# EAGLE design CCM_0013 (EAGLE 9.0.1)

## Sheet 1 of 3: CCM Subrack Bus
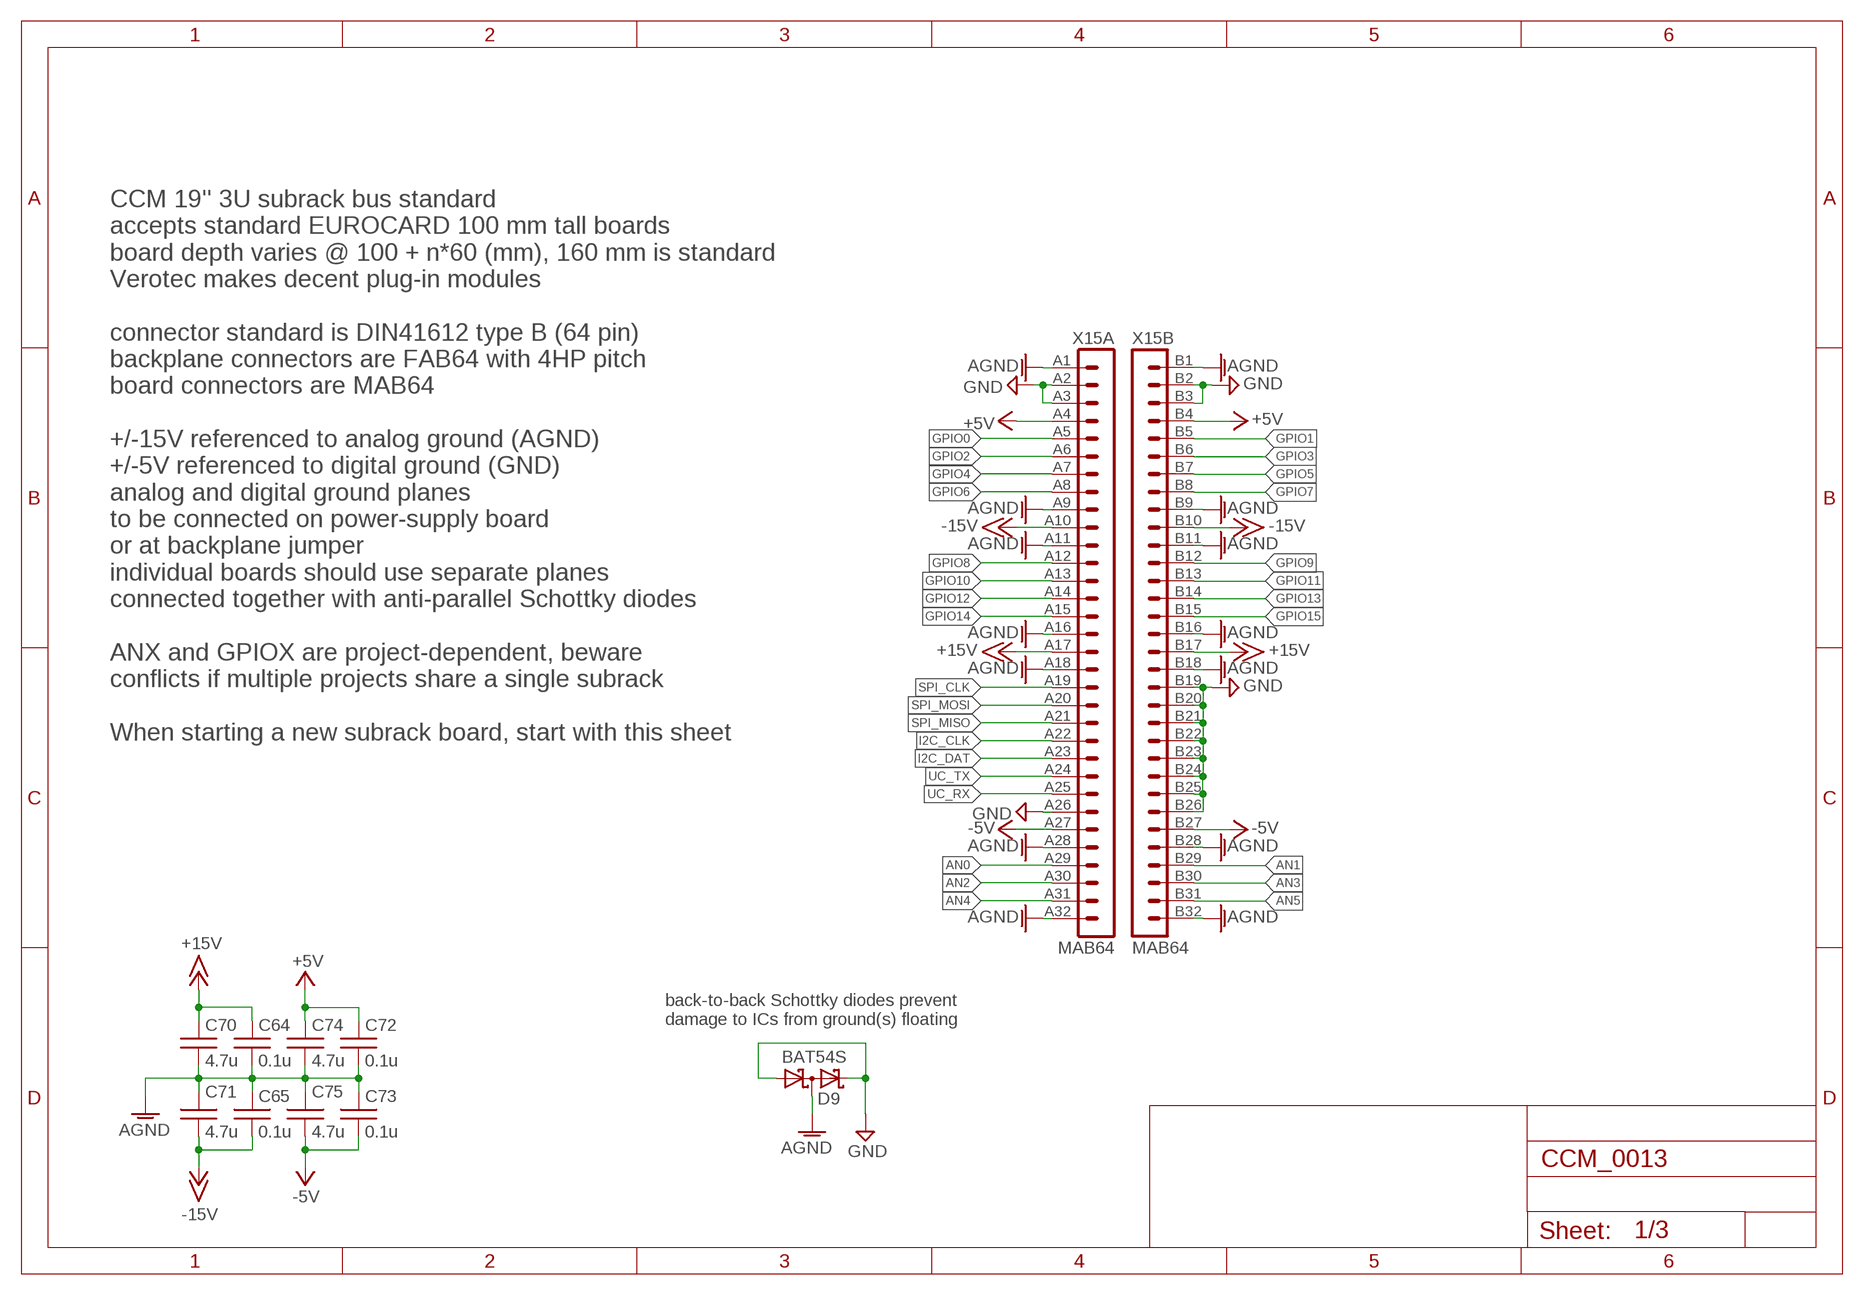
[diagram p0: schematic, sheet 1]

### Parts
C64  0.1u  C0603  [0603]
C65  0.1u  C0603  [0603]
C70  4.7u  C0603  [0603]
C71  4.7u  C0603  [0603]
C72  0.1u  C0603  [0603]
C73  0.1u  C0603  [0603]
C74  4.7u  C0603  [0603]
C75  4.7u  C0603  [0603]
D9  BAT54S  [SOT23]
X15  MAB64  [MAB64]

### Nets
+5V: C72.1 C74.1 X15.A4 X15.B4
+15V: C64.1 C70.1 X15.A17 X15.B17
-5V: C73.2 C75.2 X15.A27 X15.B27
-15V: C65.2 C71.2 X15.A10 X15.B10
AGND: C64.2 C65.1 C70.2 C71.1 D9.3(C1A2) X15.A1 X15.A9 X15.A11 X15.A16 X15.A18 X15.A28 X15.A32 X15.B1 X15.B9 X15.B11 X15.B16 X15.B18 X15.B28 X15.B32
AGND1: C72.2 C73.1 C74.2 C75.1
AN0: X15.A29
AN1: X15.B29
AN2: X15.A30
AN3: X15.B30
AN4: X15.A31
AN5: X15.B31
GND: D9.1(A1) D9.2(C2) X15.A2 X15.A3 X15.A26 X15.B2 X15.B3 X15.B19 X15.B20 X15.B21 X15.B22 X15.B23 X15.B24 X15.B25 X15.B26
GPIO0: X15.A5
GPIO1: X15.B5
GPIO2: X15.A6
GPIO3: X15.B6
GPIO4: X15.A7
GPIO5: X15.B7
GPIO6: X15.A8
GPIO7: X15.B8
GPIO8: X15.A12
GPIO9: X15.B12
GPIO10: X15.A13
GPIO11: X15.B13
GPIO12: X15.A14
GPIO13: X15.B14
GPIO14: X15.A15
GPIO15: X15.B15
I2C_CLK: X15.A22
I2C_DAT: X15.A23
SPI_CLK: X15.A19
SPI_MISO: X15.A21
SPI_MOSI: X15.A20
UC_RX: X15.A25
UC_TX: X15.A24

### Notes on the sheet
- CCM 19'' 3U subrack bus standard
  accepts standard EUROCARD 100 mm tall boards
  board depth varies @ 100 + n*60 (mm), 160 mm is standard
  Verotec makes decent plug-in modules
  
  connector standard is DIN41612 type B (64 pin)
  backplane connectors are FAB64 with 4HP pitch 
  board connectors are MAB64
  
  +/-15V referenced to analog ground (AGND)
  +/-5V referenced to digital ground (GND)
  analog and digital ground planes
  to be connected on power-supply board
  or at backplane jumper
  individual boards should use separate planes
  connected together with anti-parallel Schottky diodes
  
  ANX and GPIOX are project-dependent, beware 
  conflicts if multiple projects share a single subrack
  
  When starting a new subrack board, start with this sheet
- back-to-back Schottky diodes prevent 
  damage to ICs from ground(s) floating

## Sheet 2 of 3: supply
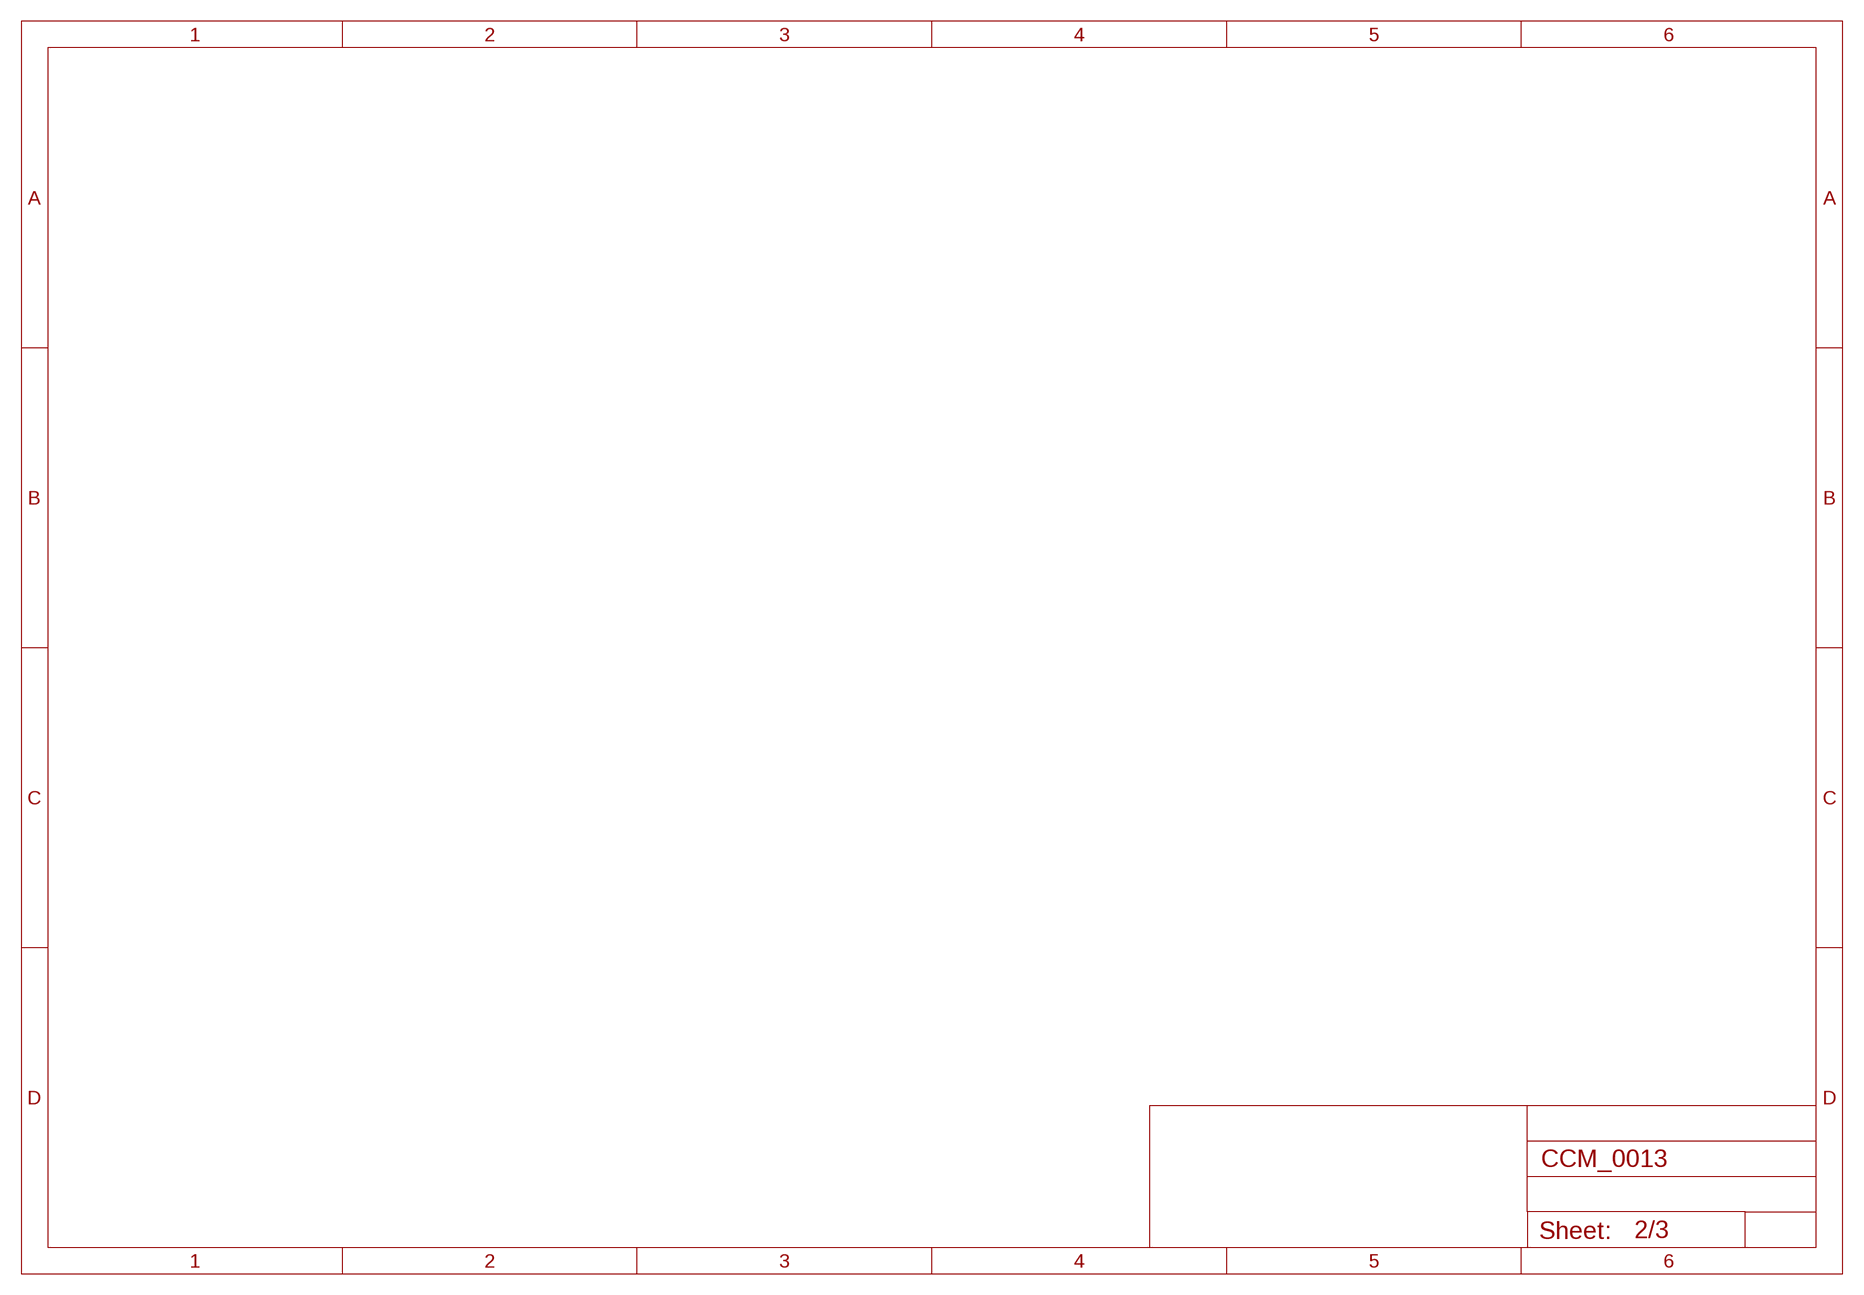
[diagram p1: schematic, sheet 2]

## Sheet 3 of 3: Mains TTL sync signal
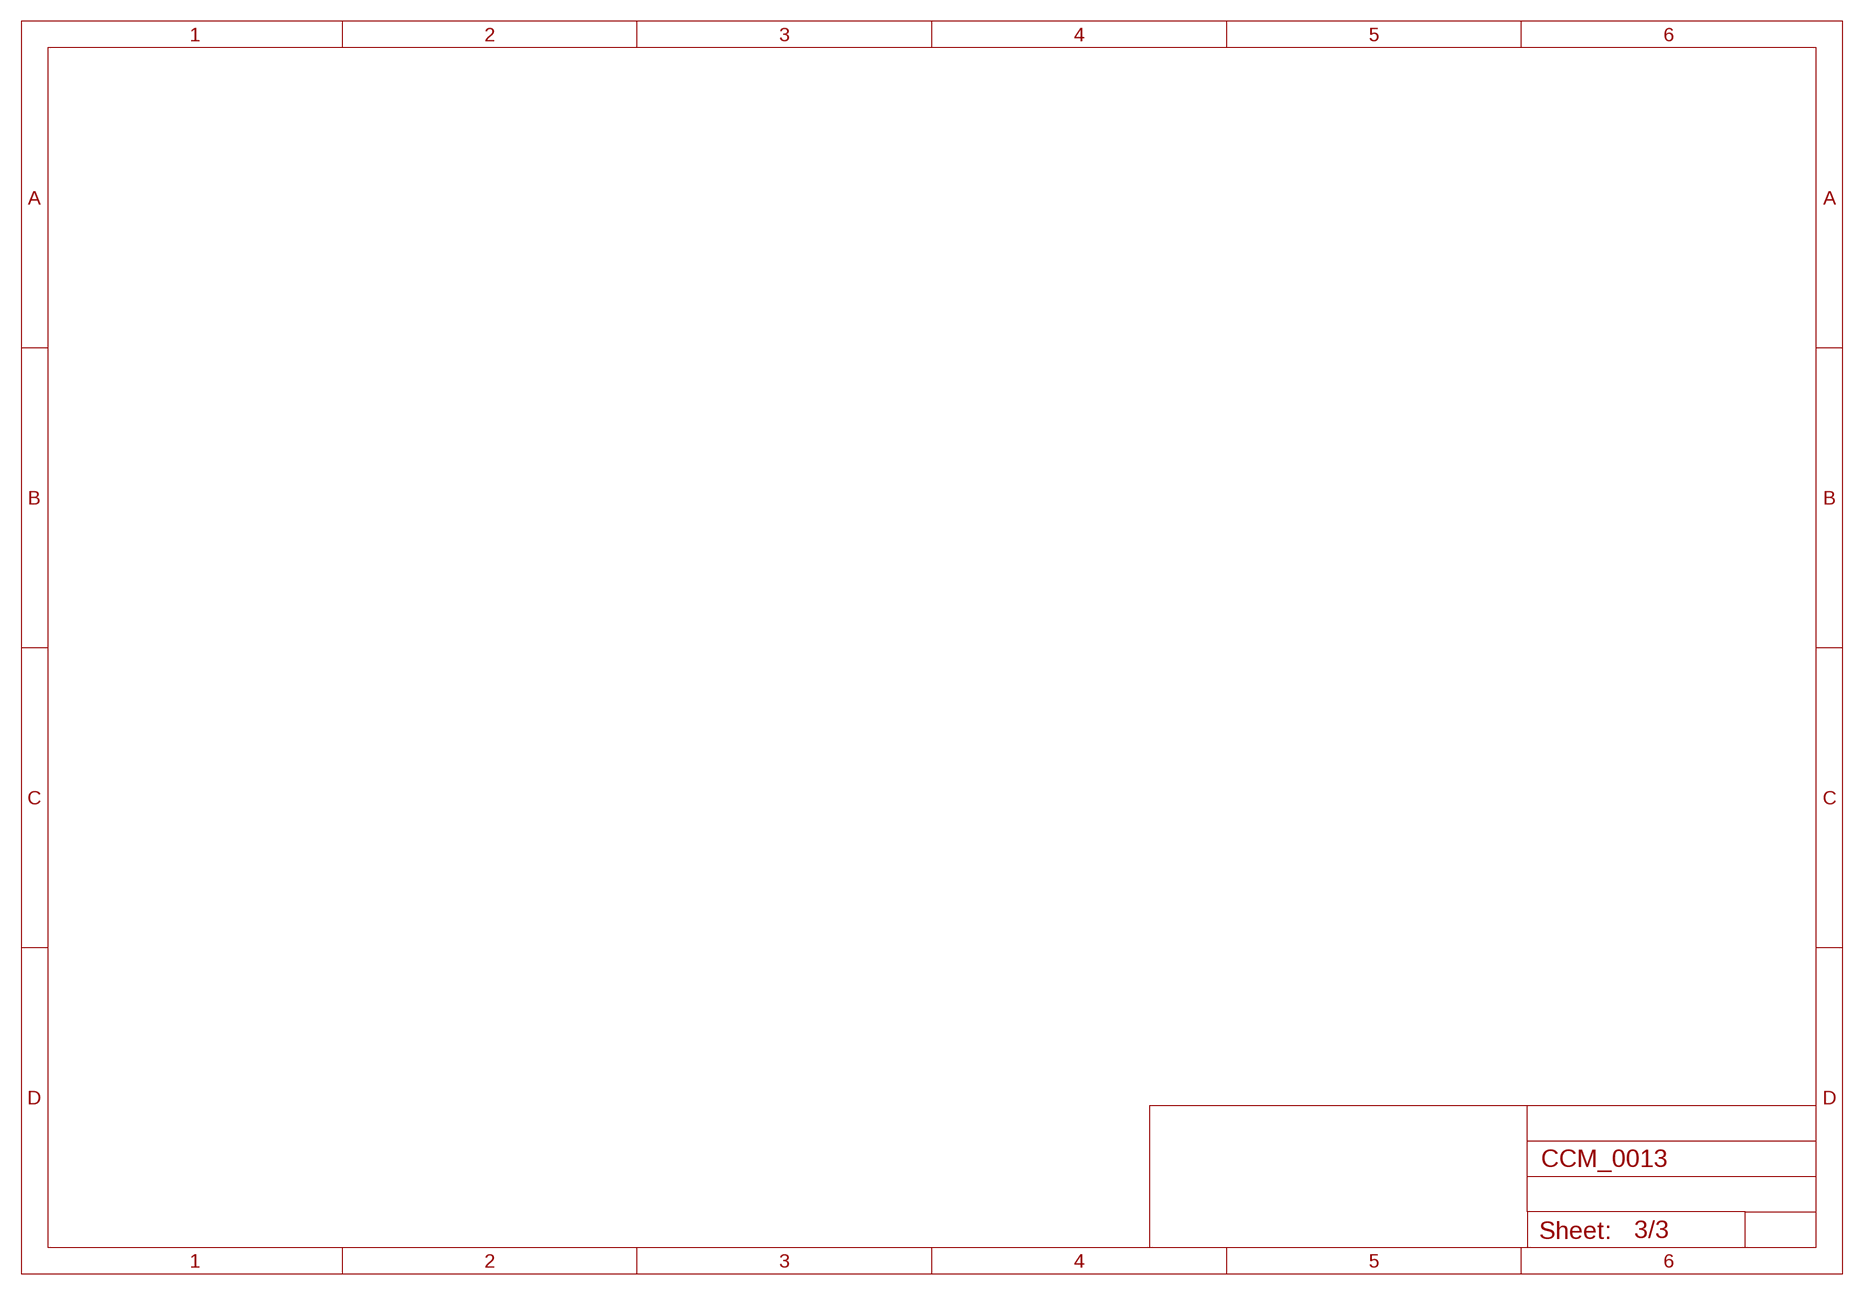
[diagram p2: schematic, sheet 3]

## Library data of the parts
C64 C65 C70-C75 = acrooptics:C: Capacitor
D9 = diode:BAT54S: Schottky Diodes Pin connection corrected 2011-05-04 Source: Fairchild .. BAT54.pdf
X15 = noah:MAB64: CONNECTOR male, 94 pins, type B, rows AB, grid 2.54 mm

## Net classes
1 standard: width 0.61 mm, clearance 0.254 mm

## Board
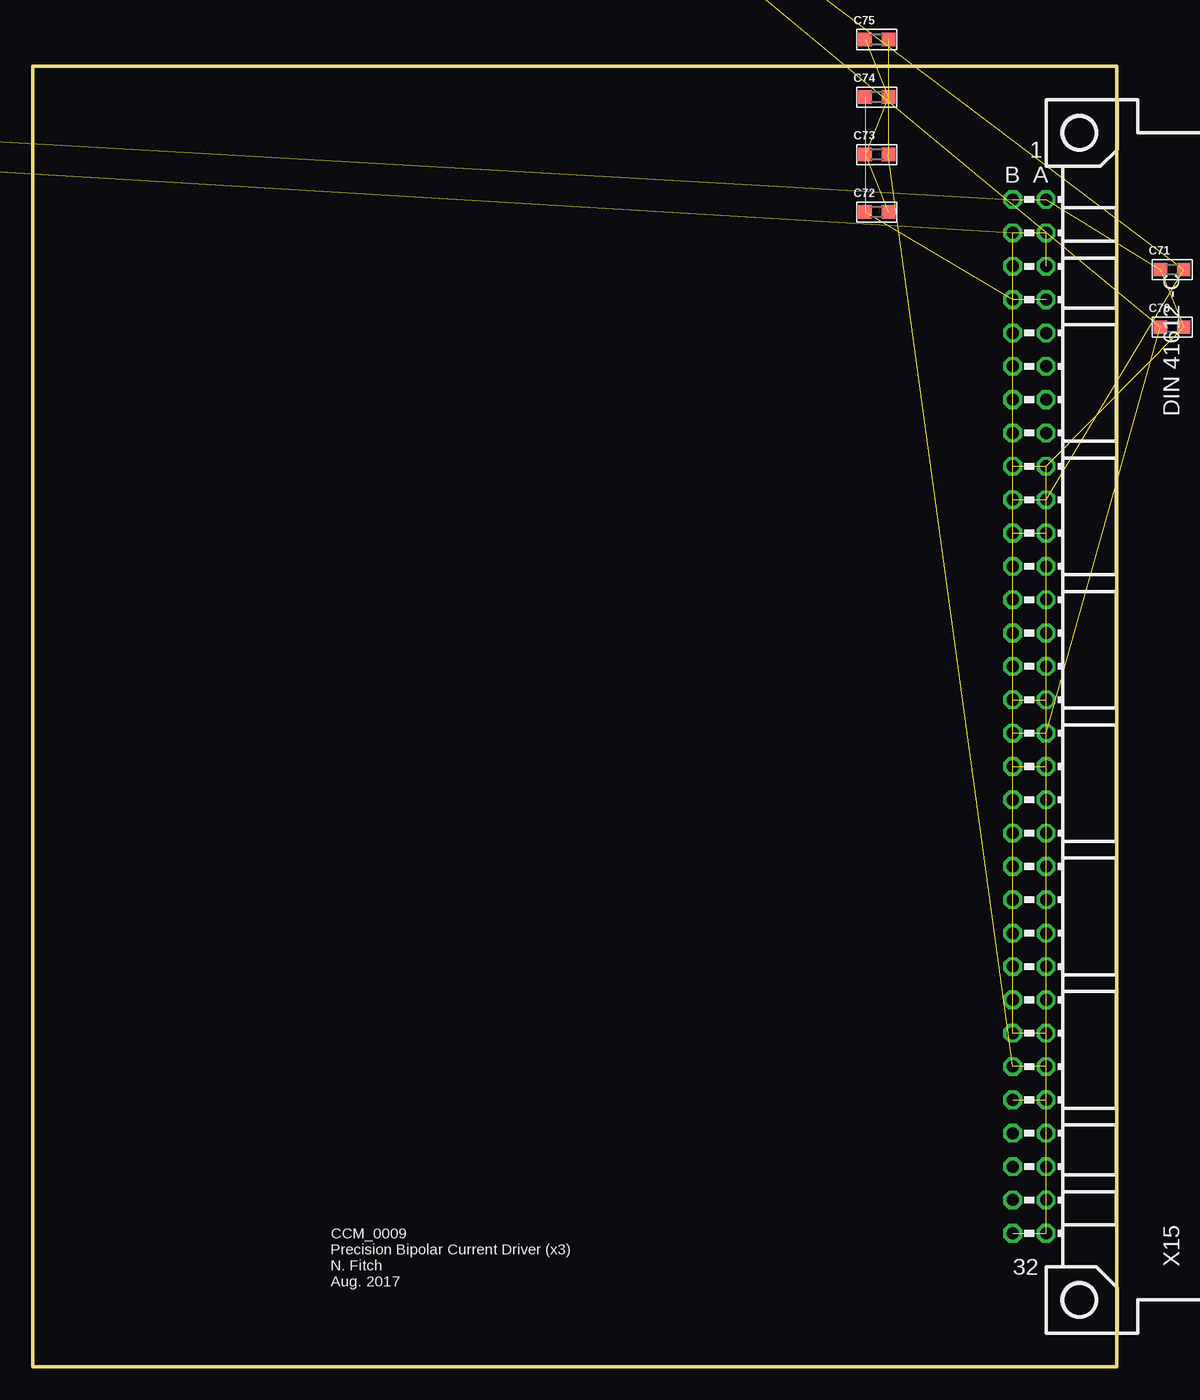
[diagram p3: board, top side]
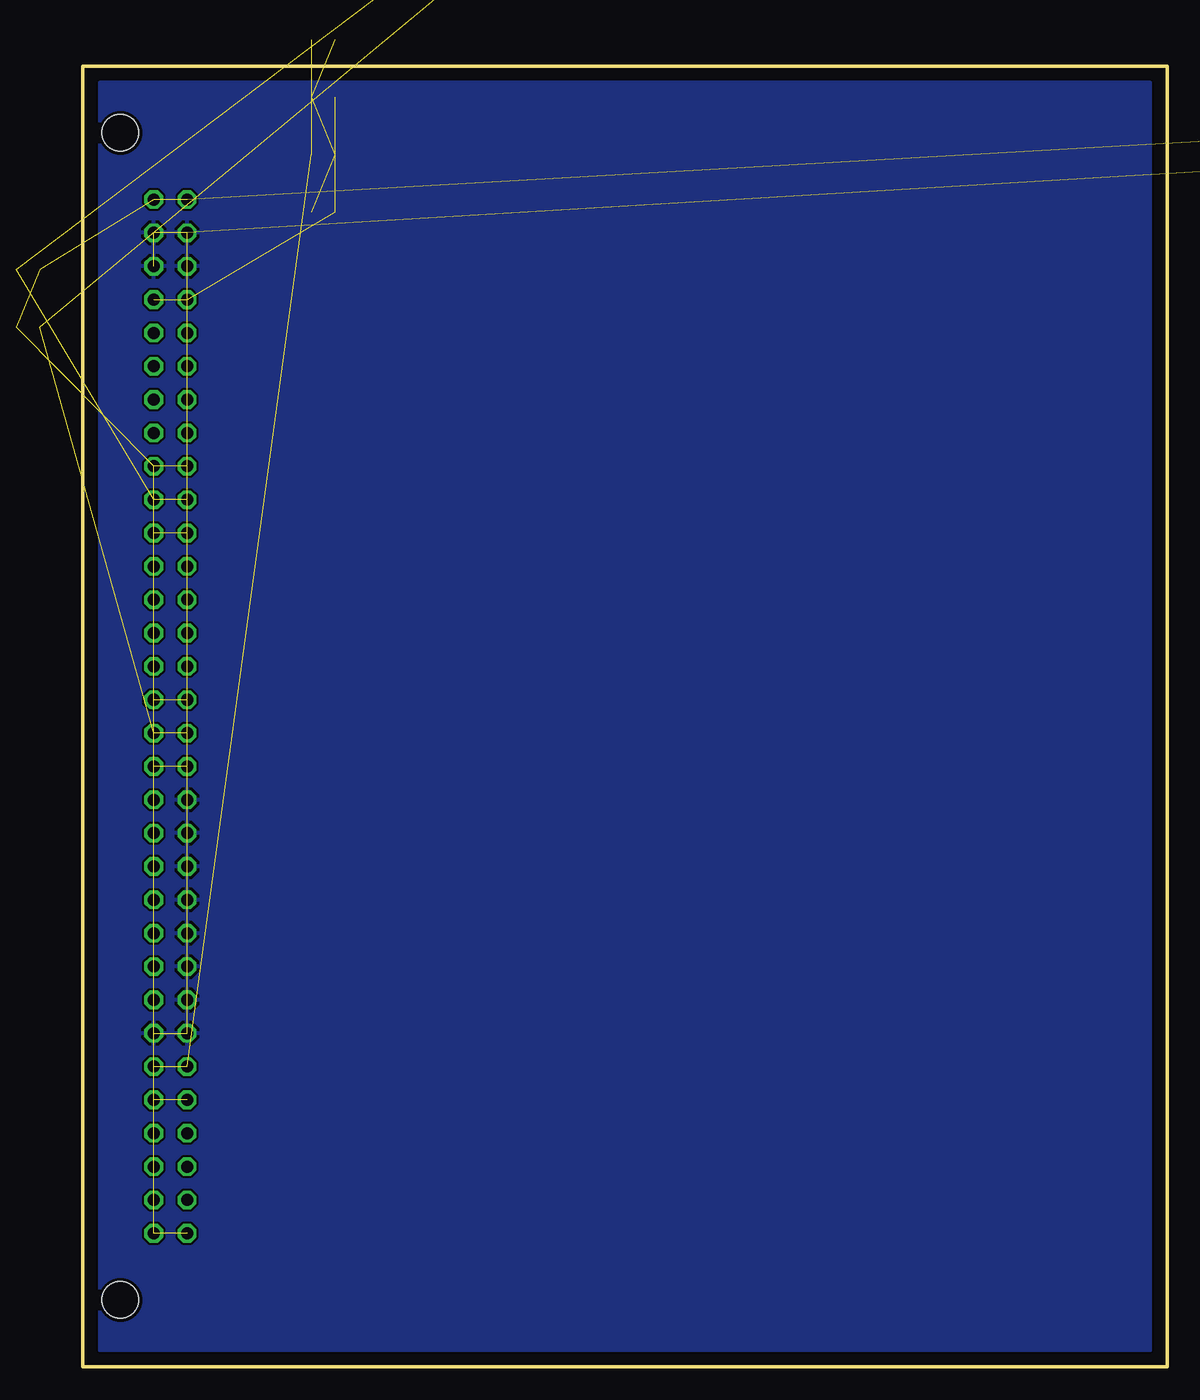
[diagram p4: board, bottom side, seen from below]

Size 82.55 x 99.06 mm. Coordinates in mm from the lower left corner, seen from the top.
Outline: 0,0 82.55,0 82.55,99.06 0,99.06 0,0
Copper layers (1*16): Top 0.035mm / dielectric 1.5mm / Bottom 0.035mm
Design rules "default *": minimum track width 10mil, minimum drill 10mil, track to track 7mil, track to pad 7mil, pad to pad 7mil, via to via 7mil, smd to smd 7mil, copper to edge 10mil, drill to drill 8mil, minimum pad ring 10mil, minimum via ring 8mil, stop-mask expansion 4mil, vias tented up to drill 0mil, thermal gap 10mil

### Footprints (pad centres in the part's own frame; a part is rotated, then mirrored left to right if it is on the bottom)
0603 = smd 1.016 x 1.016: 1 -0.889,0; 2 0.889,0
SOT23 = smd 1 x 1.4: 1 -0.95,-1.1; 2 0.95,-1.1; 3 0,1.1
MAB64 = drill 0.914 octagon: A1 -2.54,39.37; A2 -2.54,36.83; A3 -2.54,34.29; A4 -2.54,31.75; A5 -2.54,29.21; A6 -2.54,26.67; A7 -2.54,24.13; A8 -2.54,21.59; A9 -2.54,19.05; A10 -2.54,16.51; A11 -2.54,13.97; A12 -2.54,11.43; A13 -2.54,8.89; A14 -2.54,6.35; A15 -2.54,3.81; A16 -2.54,1.27; A17 -2.54,-1.27; A18 -2.54,-3.81; A19 -2.54,-6.35; A20 -2.54,-8.89; A21 -2.54,-11.43; A22 -2.54,-13.97; A23 -2.54,-16.51; A24 -2.54,-19.05; A25 -2.54,-21.59; A26 -2.54,-24.13; A27 -2.54,-26.67; A28 -2.54,-29.21; A29 -2.54,-31.75; A30 -2.54,-34.29; A31 -2.54,-36.83; A32 -2.54,-39.37; B1 -5.08,39.37; B2 -5.08,36.83; B3 -5.08,34.29; B4 -5.08,31.75; B5 -5.08,29.21; B6 -5.08,26.67; B7 -5.08,24.13; B8 -5.08,21.59; B9 -5.08,19.05; B10 -5.08,16.51; B11 -5.08,13.97; B12 -5.08,11.43; B13 -5.08,8.89; B14 -5.08,6.35; B15 -5.08,3.81; B16 -5.08,1.27; B17 -5.08,-1.27; B18 -5.08,-3.81; B19 -5.08,-6.35; B20 -5.08,-8.89; B21 -5.08,-11.43; B22 -5.08,-13.97; B23 -5.08,-16.51; B24 -5.08,-19.05; B25 -5.08,-21.59; B26 -5.08,-24.13; B27 -5.08,-26.67; B28 -5.08,-29.21; B29 -5.08,-31.75; B30 -5.08,-34.29; B31 -5.08,-36.83; B32 -5.08,-39.37 | hole 2.794: 0,44.45; 0,-44.45

### Placement (x,y rotation side)
C64  -30.86,176.85 0 top  (outside the outline)
C65  -30.86,172.47 0 top  (outside the outline)
C70  86.74,79.18 0 top  (outside the outline)
C71  86.74,83.57 0 top  (outside the outline)
C72  64.26,87.95 0 top
C73  64.26,92.33 0 top
C74  64.26,96.71 0 top
C75  64.26,101.09 0 top
D9  -53.53,95.12 0 top  (outside the outline)
X15  79.69,49.53 0 top

### Tracks (layer width: path | path; a pad name or v marks a point on that pad's centre or on a via)
+5V  (3 unrouted)
+15V  (3 unrouted)
-5V  (3 unrouted)
-15V  (3 unrouted)
AGND  (18 unrouted)
AGND1  (3 unrouted)
GND  (14 unrouted)
  pour Bottom: 1.27,1.27 1.27,97.79 81.28,97.79 81.28,1.27

### Text on the board
tPlace: CCM_0009 / Precision Bipolar Current Driver (x3) / N. Fitch / Aug. 2017